# EAGLE design untitled2sch (EAGLE 6.6.0)
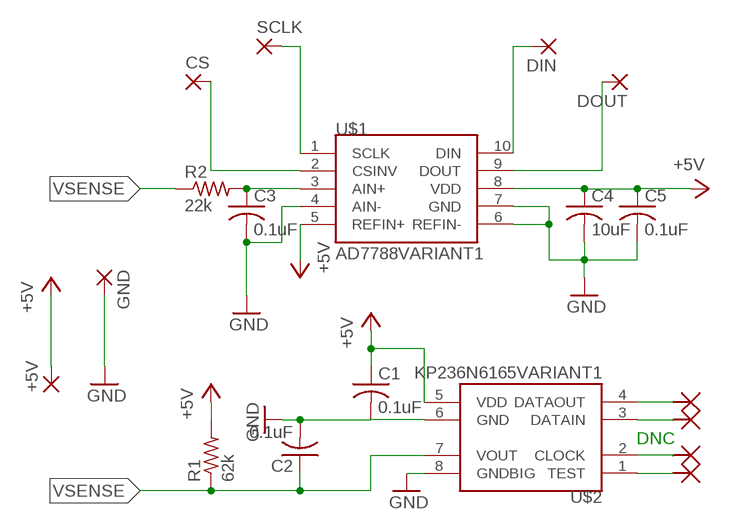
[diagram p0: schematic, sheet 1]

## Parts
+5V  WIREPAD1,6/0,8  [1,6/0,8]
C1  0.1uF  C-USC0603K  [C0603K]
C2  0.1uF  C-USC0603K  [C0603K]
C3  0.1uF  C-USC0603K  [C0603K]
C4  10uF  C-USC0603K  [C0603K]
C5  0.1uF  C-USC0603K  [C0603K]
CS  WIREPAD1,6/0,8  [1,6/0,8]
DIN  WIREPAD1,6/0,8  [1,6/0,8]
DOUT  WIREPAD1,6/0,8  [1,6/0,8]
GND  WIREPAD1,6/0,8  [1,6/0,8]
R1  62k  R-US_R0805  [R0805]
R2  22k  R-US_R0805  [R0805]
SCLK  WIREPAD1,6/0,8  [1,6/0,8]
U$1  AD7788VARIANT1  [AD7788]
U$2  KP236N6165VARIANT1  [KP236N6165]

## Nets
0.010: +5V.1(P) C1.1 C4.1 C5.1 R1.2 U$1.5(REFIN+) U$1.8(VDD) U$2.5(VDD) ; supply symbol labelled +5V
GND: C1.2 C2.2 C3.2 C4.2 C5.2 GND.1(P) U$1.4(AIN-) U$1.6(REFIN-) U$1.7(GND) U$2.6(GND) U$2.8(GNDBIG)
N$1: CS.1(P) U$1.2(CSINV)
N$2: U$2.1(TEST)
N$3: DIN.1(P) U$1.10(DIN)
N$4: DOUT.1(P) U$1.9(DOUT)
N$5: U$2.2(CLOCK)
N$6: U$2.3(DATAIN)
N$7: U$2.4(DATAOUT)
RENAMED: C3.1 R2.2 U$1.3(AIN+)
SCLK: SCLK.1(P) U$1.1(SCLK)
VSENSE: C2.1 R1.1 R2.1 U$2.7(VOUT)

## Notes on the sheet
- DNC

## Library data of the parts
+5V CS DIN DOUT GND SCLK = wirepad:WIREPAD: Wire PAD connect wire on PCB
C1-C5 = rcl:C-US: CAPACITOR, American symbol
R1 R2 = resistor:R-US_: RESISTOR, American symbol
U$1 = evan1:AD7788
U$2 = evan1:KP236N6165

## Board
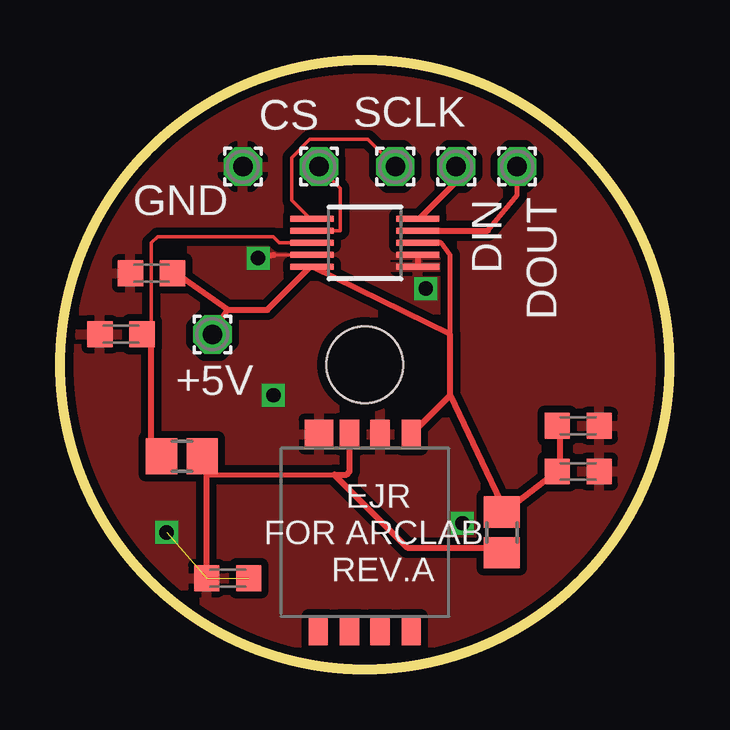
[diagram p1: board, top side]
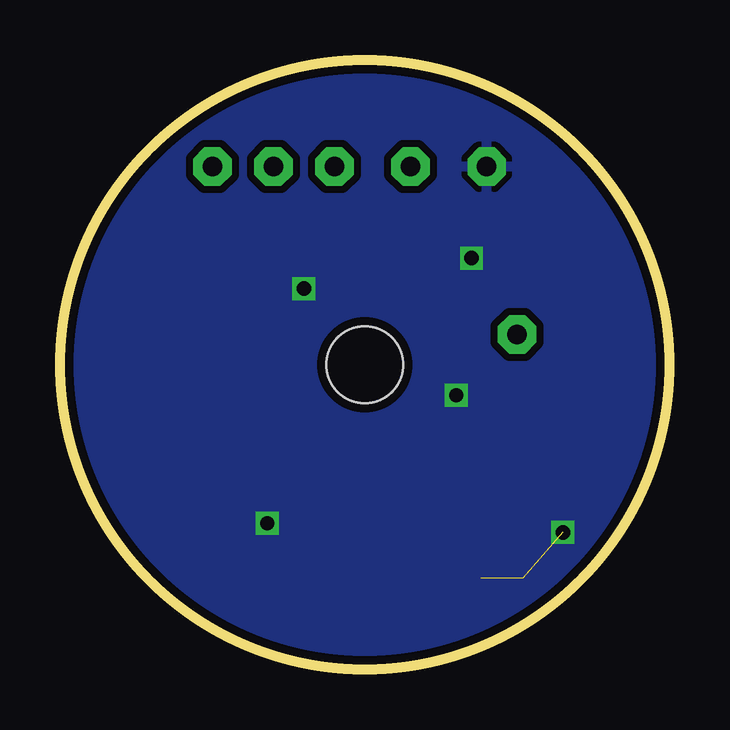
[diagram p2: board, bottom side, seen from below]

Size 25.4 x 25.4 mm. Coordinates in mm from the lower left corner, seen from the top.
Outline: circle at 12.7,12.7 radius 12.7
Copper layers (1*16): Top 0.0356mm / dielectric 1.5011mm / Bottom 0.0356mm
Design rules "OSHParkPCBOrder": minimum track width 6mil, minimum drill 13mil, track to track 6mil, track to pad 6mil, pad to pad 6mil, via to via 6mil, smd to smd 6mil, copper to edge 15mil, drill to drill 6mil, minimum pad ring 7mil, minimum via ring 7mil, stop-mask expansion 3mil, vias tented up to drill 0mil, thermal gap 10mil
Holes 3.2 mm at 12.7,12.7

### Footprints (pad centres in the part's own frame; a part is rotated, then mirrored left to right if it is on the bottom)
1,6/0,8 = drill 0.813 pad 1.6 octagon: 1 0,0
C0603K = smd 1.05 x 1.08: 1 -0.875,0; 2 0.875,0
R0805 = smd 1.3 x 1.5: 1 -0.85,0; 2 0.85,0
AD7788 = smd 1.8 x 0.25: 1 -2.2,1; 2 -2.2,0.5; 3 -2.2,0; 4 -2.2,-0.5; 5 -2.2,-1; 6 2.2,-1; 7 2.2,-0.5; 8 2.2,0; 9 2.2,0.5; 10 2.2,1
KP236N6165 = smd 1.2 x 0.8: 1 -4.1,1.935; 2 -4.1,0.635; 3 -4.1,-0.635; 4 -4.1,-1.935; 5 4.1,-1.935; 6 4.1,-0.635; 7 4.1,0.635 | smd 1.2 x 1.2: 8 4.1,1.905

### Placement (x,y rotation side)
+5V  6.35,13.97 0 top
C1  3.81,16.51 180 top
C2  6.99,3.81 180 top
C3  2.54,13.97 180 top
C4  21.59,10.16 0 top
C5  21.59,8.26 0 top
CS  10.79,20.95 90 top
DIN  16.51,20.95 0 top
DOUT  19.05,20.95 270 top
GND  7.62,20.95 180 top
R1  18.41,5.71 90 top
R2  5.08,8.89 180 top
SCLK  13.97,20.95 180 top
U$1  12.7,17.78 0 top
U$2  12.7,5.71 90 top

### Tracks (layer width: path | path; a pad name or v marks a point on that pad's centre or on a via)
0.010
  Top 0.152: 4.83,16.51 C1.1 | 10.41,16.76 U$1.5 10.67,16.76 | 20.83,8.38 C5.1 | 20.83,10.16 C4.1 | 18.54,6.6 R1.2
  Top 0.203: 16.26,13.97 16.26,17.27 15.88,17.78 U$1.8
  Top 0.254: 6.99,14.99 4.83,16.51 | +5V.1 6.99,14.99 | 10.41,16.76 8.64,14.99 6.99,14.99 | 20.83,10.16 20.83,8.38 | 16.26,11.43 16.26,13.97 U$1.5 | 16.26,11.43 18.54,6.6 C5.1 | 16.26,11.43 U$2.5
GND  (via drill 0.6)  (1 unrouted)
  Top 0.152: U$1.4 8.89,17.27
  Top 0.254: U$1.7 U$1.6 | 8.89,17.27 v8.26,17.14
  other vias: 8.89,11.43 4.45,5.71 15.24,15.88 16.76,6.1
  pour Top (isolate 0.305): 0,0 -2.54,0 -2.54,26.67 26.67,26.67 26.67,-1.27 0,-1.27
  pour Bottom (isolate 0.305): 3.81,24.13 -2.54,24.13 -2.54,5.08 1.27,5.08 1.27,0 7.62,0 7.62,-1.27 26.67,-1.27 26.67,27.94 3.81,27.94
N$1
  Top 0.152: CS.1 11.68,20.07 11.68,18.29 10.67,18.29 U$1.2
N$3
  Top 0.152: 14.99,18.8 U$1.10
  Top 0.229: 14.99,18.8 16.51,20.32 DIN.1
N$4
  Top 0.203: 17.82,18.29 19.05,19.77 DOUT.1 | U$1.9 14.73,18.29
  Top 0.254: 14.73,18.29 17.82,18.29
RENAMED
  Top 0.152: 3.81,13.72 3.56,13.97 C3.1 3.81,13.72 | 3.81,8.64 R2.2 | U$1.3 9.14,17.78 8.89,18.03 4.06,18.03 3.81,17.78 3.81,13.72
  Top 0.254: 3.81,8.64 3.81,13.72
SCLK
  Top 0.152: SCLK.1 12.83,22.1 10.41,22.1 9.65,21.34 9.65,19.56 10.41,18.8 U$1.1
VSENSE  (1 unrouted)
  Top 0.152: 6.1,8.13 6.1,8.89 R2.1 | 18.29,5.08 R1.1
  Top 0.203: 6.1,8.13 11.43,8.13
  Top 0.254: 6.1,8.13 6.1,3.81 | 18.29,5.08 14.48,5.08 11.43,8.13 11.94,8.13 12.06,8.26 U$2.7

### Text on the board
tPlace: EJR / FOR ARCLAB / REV.A